# EAGLE design connectors (EAGLE 7.6.0)
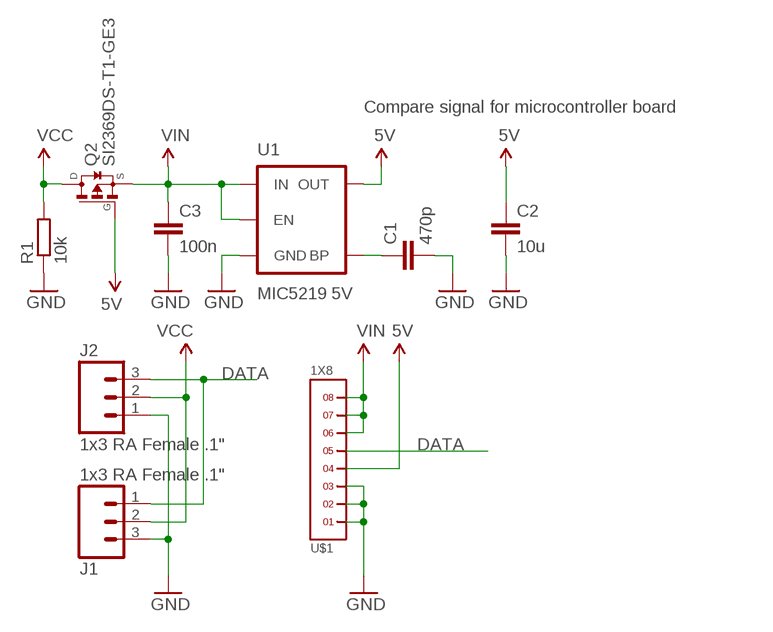
[diagram p0: schematic, sheet 1]

## Parts
C1  470p  C-EUC0402K  [C0402K]
C2  10u  C-EUC0603K  [C0603K]
C3  100n  C-EUC0402K  [C0402K]
J1  1x3 RA Female .1"  M03SMD_RA_FEMALE  [1X03_SMD_RA_FEMALE]
J2  1x3 RA Female .1"  M03SMD_RA_FEMALE  [1X03_SMD_RA_FEMALE]
Q2  SI2369DS-T1-GE3  SI2333DS  [SOT23]
R1  10k  R-EU_R0603  [R0603]
U1  MIC5219 5V  V_REG_MIC52195V  [SOT23-5]
U$1  1X8  [1X8]

## Nets
5V: C2.1 Q2.1(G) U1.5(OUT) U$1.4
DATA: J1.1 J2.3 U$1.5
GND: C1.2 C2.2 C3.2 J1.3 J2.1 R1.1 U1.2(GND) U$1.1 U$1.2 U$1.3
N$1: C1.1 U1.4(BP)
VCC: J1.2 J2.2 Q2.3(D) R1.2
VIN: C3.1 Q2.2(S) U1.1(IN) U1.3(EN) U$1.6 U$1.7 U$1.8

## Notes on the sheet
- Compare signal for microcontroller board

## Library data of the parts
C1-C3 = rcl:C-EU: CAPACITOR, European symbol
J1 J2 = SparkFun-Connectors:M03: Header 3 Standard 3-pin 0.1" header. Use with straight break away headers (SKU : PRT-00116), right angle break away headers (PRT-00553), swiss pins (PRT-00743), machine pins (PRT-00117), and female headers (PRT-00115). Molex polarized connector foot print use with SKU : PRT-08232 with associated crimp pins and housings.; PROD_ID: CONN-10926
Q2 = transistor-fet:SI2333DS: P-Channel MOSFET
R1 = rcl:R-EU_: RESISTOR, European symbol
U1 = SparkFun-PowerIC:V_REG_MIC5219: V_REG MIC5219 Standard 3.3V and 5V 500mA LDO voltage regulator in SOT-23 layout. Micrel part MIC5219. BP (by-pass) pin is used to lower output noise with 470pF cap, may be left open.; PROD_ID: VREG-10107
U$1 = headers(.05in):1X8

## Board
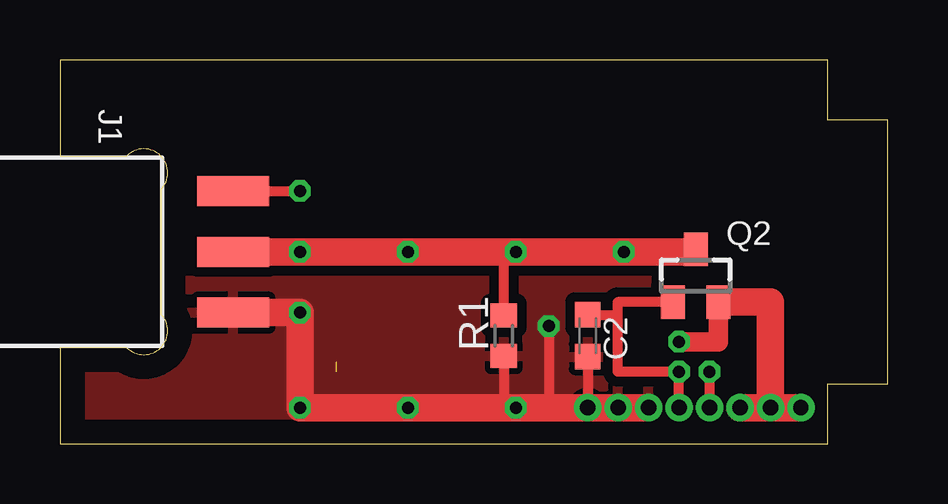
[diagram p1: board, top side]
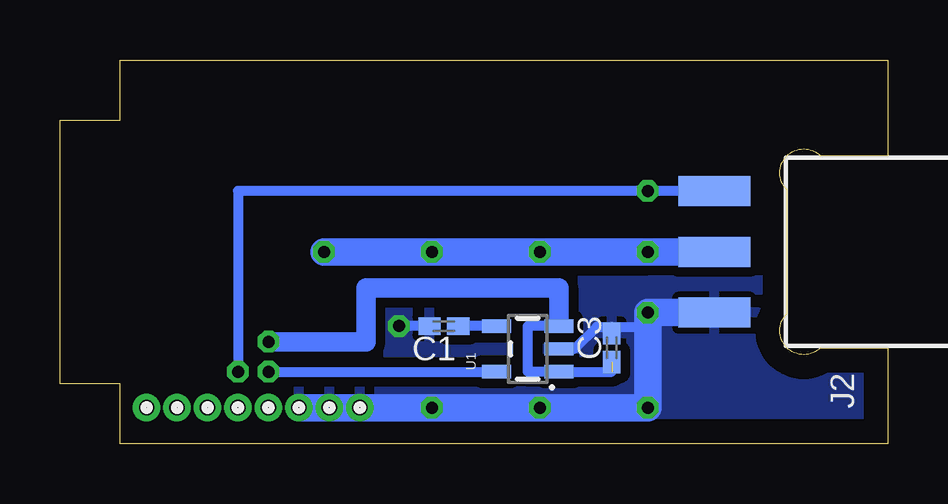
[diagram p2: board, bottom side, seen from below]

Size 34.5 x 16 mm. Coordinates in mm from the lower left corner, seen from the top.
Outline: 2.79,4 0,4 0,0 32,0 32,2.5 34.5,2.5 34.5,13.5 32,13.5 32,16 0,16 0,12 2.79,12 arc-180 4.2,10.59 4.2,5.41 arc-180 2.79,4
Copper layers (1*16): Top 0.035mm / dielectric 1.5mm / Bottom 0.035mm
Design rules "default": minimum track width 10mil, minimum drill 24mil, track to track 8mil, track to pad 8mil, pad to pad 8mil, via to via 8mil, smd to smd 8mil, copper to edge 40mil, drill to drill 8mil, minimum pad ring 10mil, minimum via ring 8mil, stop-mask expansion 4mil, vias tented up to drill 0mil, thermal gap 10mil

### Footprints (pad centres in the part's own frame; a part is rotated, then mirrored left to right if it is on the bottom)
C0402K = smd 0.925 x 0.74: 1 -0.6,0; 2 0.6,0
C0603K = smd 1.05 x 1.08: 1 -0.875,0; 2 0.875,0
1X03_SMD_RA_FEMALE = smd 1.25 x 3: 1 -2.54,7.225; 2 0,7.225; 3 2.54,7.225
SOT23 = smd 1 x 1.4: 1 -0.95,-1.1; 2 0.95,-1.1; 3 0,1.1
R0603 = smd 1 x 1.1: 1 -0.85,0; 2 0.85,0
SOT23-5 = smd 0.55 x 1.2: 1 -0.95,-1.3; 2 0,-1.3; 3 0.95,-1.3; 4 0.95,1.3; 5 -0.95,1.3
1X8 = drill 0.635 pad 1.016: 1 0,0; 2 1.27,0; 3 2.54,0; 4 3.81,0; 5 5.08,0; 6 6.35,0; 7 7.62,0; 8 8.89,0

### Placement (x,y rotation side)
C1  18.5,4.9 180 bottom
C2  22,4.5 270 top
C3  11.5,4 90 bottom
J1  0,8 270 top
J2  0,8 90 bottom
Q2  26.5,7 0 top
R1  18.5,4.5 90 top
U1  15,3.95 90 bottom
U$1  22,1.5 180 bottom

### Tracks (layer width: path | path; a pad name or v marks a point on that pad's centre or on a via)
5V  (via drill 0.5)
  Top 0.406: U$1.4 v25.81,3 23.25,3 23.25,5.38 | Q2.1 23.25,5.9 23.25,5.38 | C2.1 23.25,5.38
  Bottom 0.406: v25.81,3 U1.5
DATA  (via drill 0.5)
  Top 0.406: J1.1 v10,10.54 | v27.08,3 U$1.5
  Bottom 0.406: J1.1 v10,10.54 27.08,10.54 v27.08,3
GND  (via drill 0.5)
  Top 0.406: v20.38,4.9 20.38,1.5 | R1.1 18.5,1.5 | C2.2 U$1.1
  Top 1.14: U$1.3 U$1.2 U$1.1 20.38,1.5 v19,1.5 18.5,1.5 v14.5,1.5 v10,1.5 v10,5.46 J1.3
  Bottom 0.406: 10,4.75 10.12,4.88 11.5,4.88 | U1.2 13.05,3.95 12.12,4.88 11.5,4.88 | C1.2 v20.38,4.9 | C3.2 11.5,4.88
  Bottom 1.14: 24.5,1.5 v19,1.5 v14.5,1.5 v10,1.5 10,4.75 v10,5.46 J1.3
  pour Top (isolate 0.406): -1,17.5 36,17.5 36,-1.5 -1,-1.5
  pour Bottom (isolate 0.406): -2,18.5 37,18.5 37,-2.5 -2,-2.5
N$1
  Bottom 0.406: U1.4 C1.1
VCC  (via drill 0.5)
  Top 0.406: 26.25,8 26.5,8 | R1.2 18.5,8
  Top 0.813: Q2.3 26.5,8
  Top 1.14: J1.2 v10,8 v14.5,8 18.5,8 v19,8 v23.5,8 26.25,8
  Bottom 1.14: J1.2 v10,8 v14.5,8 v19,8 v23.5,8
VIN  (via drill 0.5)  (1 unrouted)
  Top 0.813: v25.81,4.25 27.45,4.25 Q2.2 27.75,5.9
  Top 1.14: U$1.8 U$1.7 | U$1.7 U$1.6 | U$1.7 29.62,5.9 27.75,5.9
  Bottom 0.406: 13.7,5.25 U1.3 15,4.9 15,3 U1.1 11.5,3
  Bottom 0.813: v25.81,4.25 21.75,4.25 21.75,6.5 13.7,6.5 13.7,5.25